# Altium project RFSOC_SAWG.PrjPCB (part 6 of 10)

## Sheet AWG_EEM_Connectors_JTAG.SchDoc: EEM Connectors,
size 420 x 297 mm; EDA_Number: ARTIQ; CompanyName: WUT ISE; DrawnBy: G.Kasprowicz; Organization: WUT ISE; DocumentNumber: 6; Revision: 1; SheetNumber: 6; SheetTotal: 20; Title2: JTAG switches; Designer: G.Kasprowicz; ModifiedDate: -; ProjectName: RFSOC_SAWG.PrjPCB
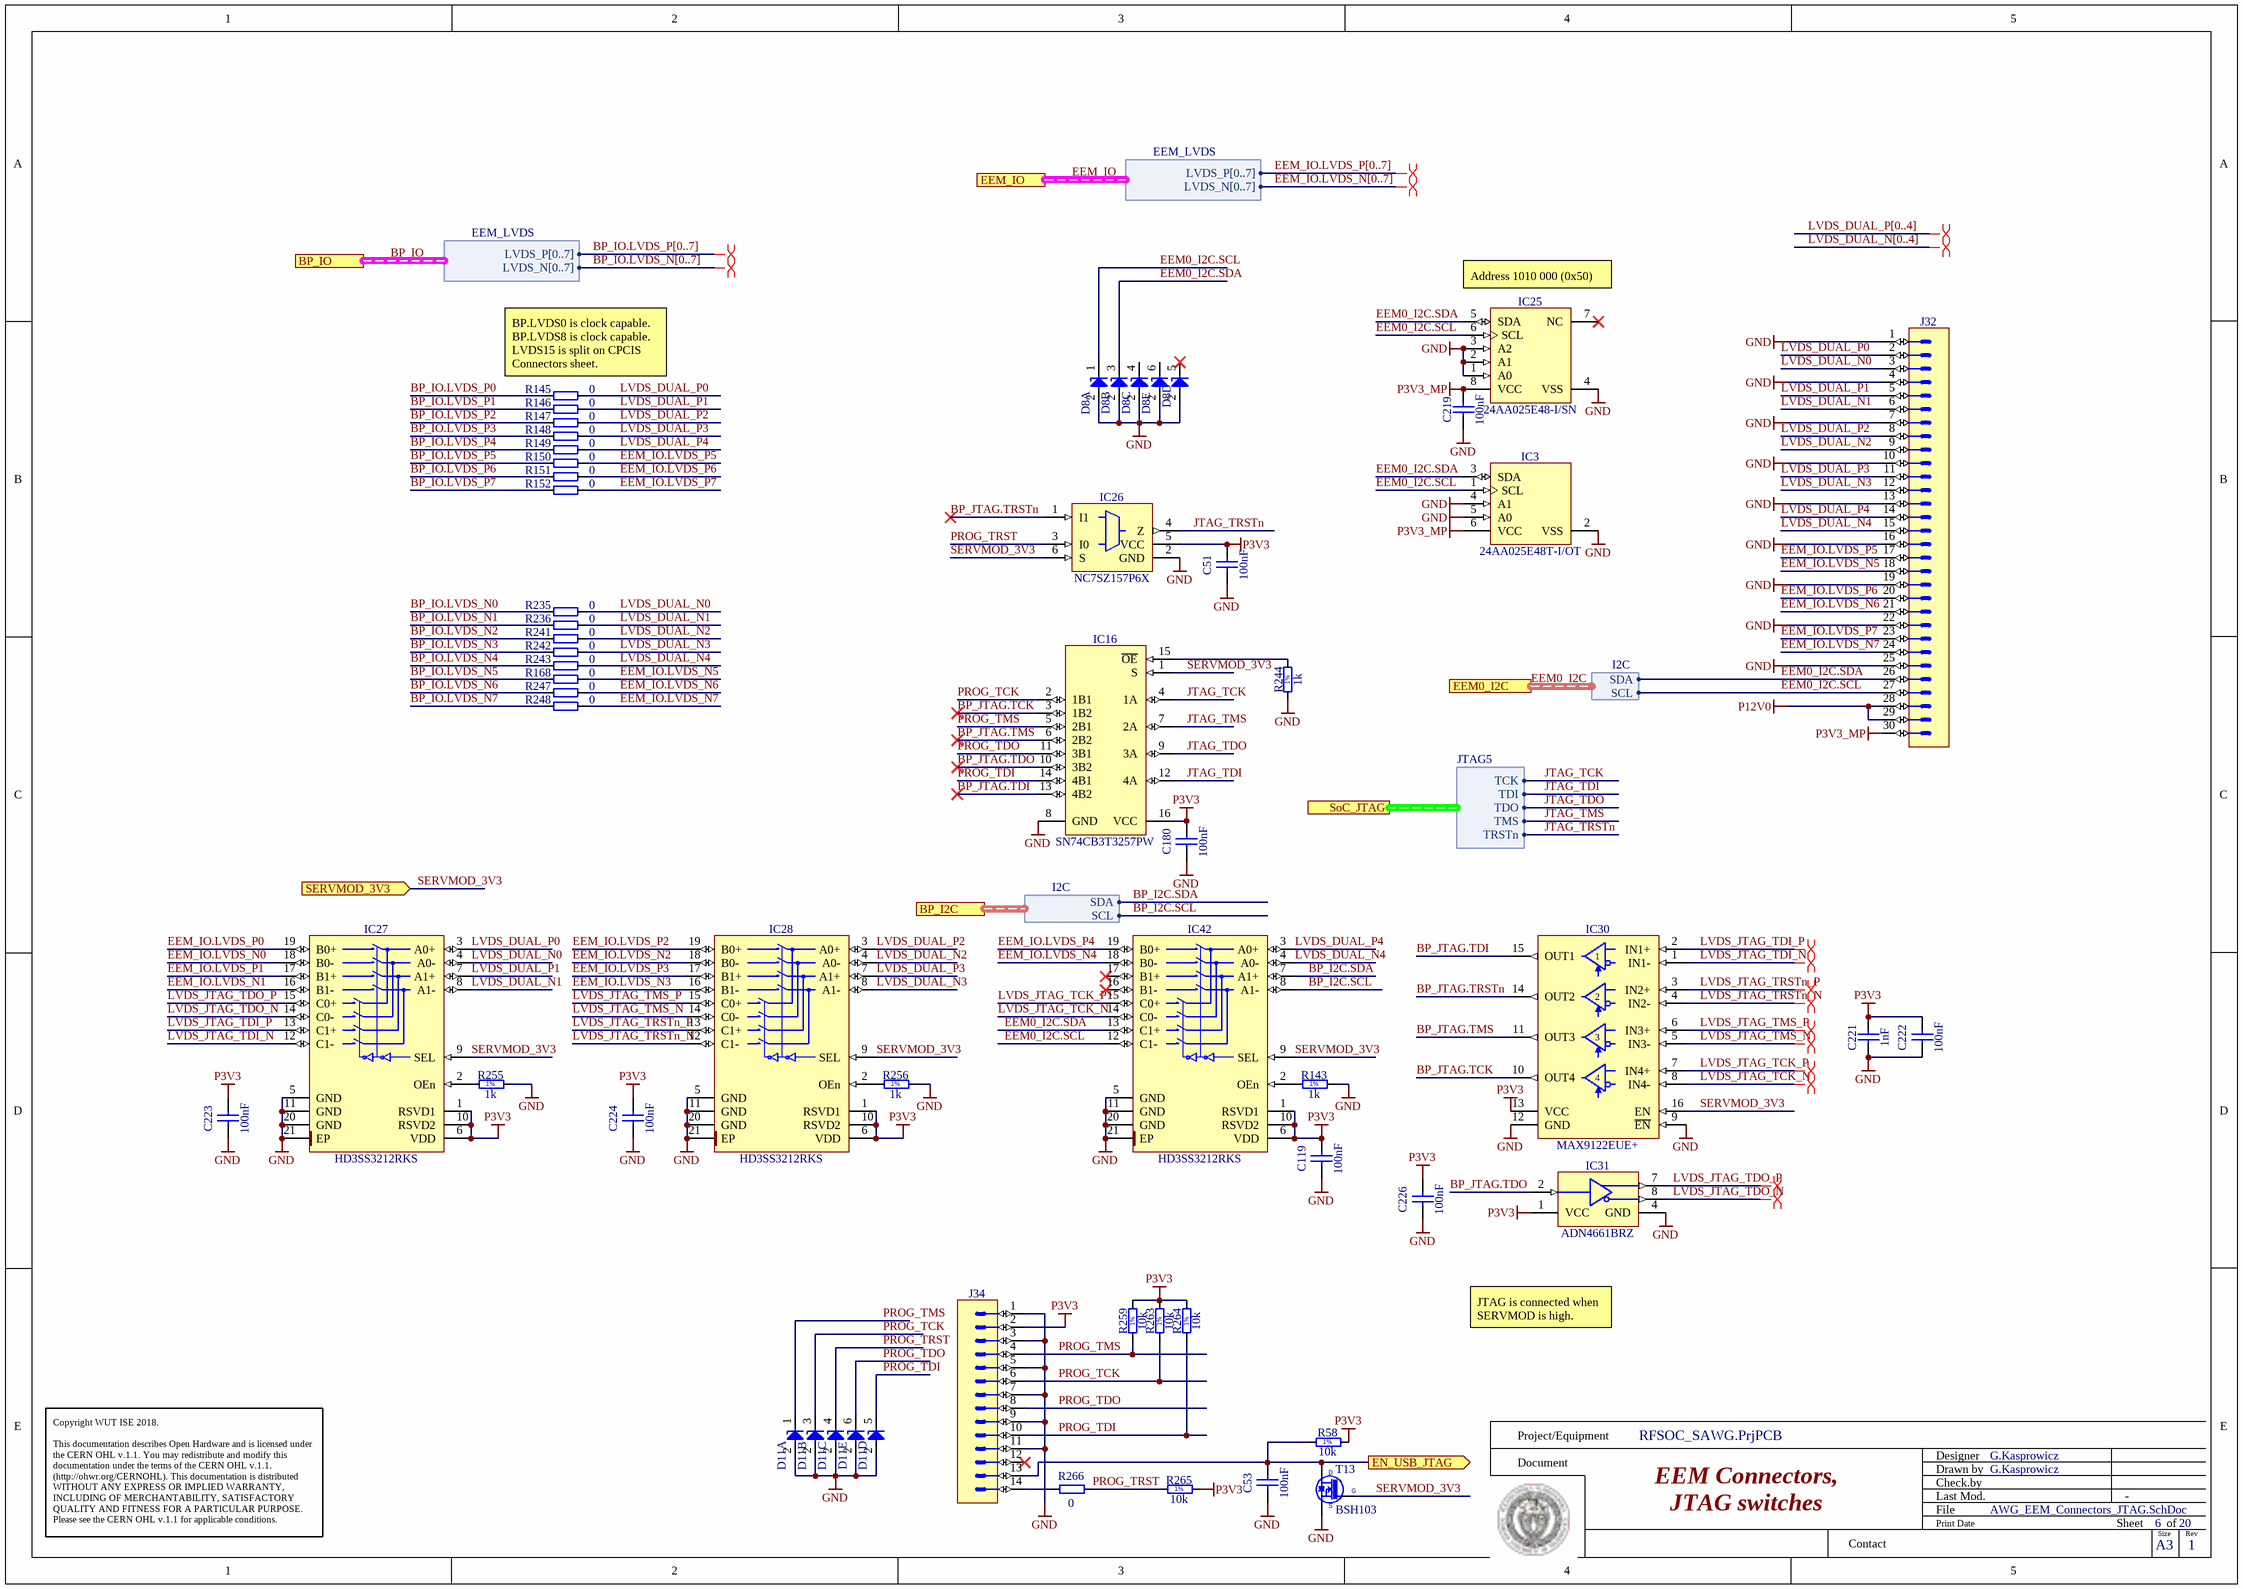
[diagram p11: AWG_EEM_Connectors_JTAG.SchDoc]

### Parts
C51  100nF  [CAPC1005X55N]
C53  100nF  [CAPC1005X55N]
C119  100nF  [CAPC1005X55N]
C180  100nF  [CAPC1005X55N]
C219  100nF  [CAPC1005X55N]
C221  1nF  [CAPC1005X55N]
C222  100nF  [CAPC1005X55N]
C223  100nF  [CAPC1005X55N]
C224  100nF  [CAPC1005X55N]
C226  100nF  [CAPC1005X55N]
D8  PESD3V3L5UY  [SOT65P210X110-6N]  (value not drawn)  (parts A,B,C,D,E of 5)
D11  PESD3V3L5UY  [SOT65P210X110-6N]  (value not drawn)  (parts A,B,C,D,E of 5)
IC3  24AA025E48T-I/OT  [SOT95P280X145-6N]
IC16  SN74CB3T3257PW  [SOP65P640X120-16N]
IC25  24AA025E48-I/SN  [SOIC127P600X175-8N]
IC26  NC7SZ157P6X  [SOT65P210X110-6N]
IC27  HD3SS3212RKS  [TEXAS_RKS0020A]
IC28  HD3SS3212RKS  [TEXAS_RKS0020A]
IC30  MAX9122EUE+  [SOP65P640X110-16N]
IC31  ADN4661BRZ  [SOIC127P600X175-8N]
IC42  HD3SS3212RKS  [TEXAS_RKS0020A]
J32  (no value)  [3M_N2530-6002RB]
J34  Milli-Grid™  [MOLEX_87832-1420]  (value not drawn)
R58  10k  [RESC1005X40N]
R143  1k  [RESC1005X40N]
R145  0  [RESC1005X40N]
R146  0  [RESC1005X40N]
R147  0  [RESC1005X40N]
R148  0  [RESC1005X40N]
R149  0  [RESC1005X40N]
R150  0  [RESC1005X40N]
R151  0  [RESC1005X40N]
R152  0  [RESC1005X40N]
R168  0  [RESC1005X40N]
R235  0  [RESC1005X40N]
R236  0  [RESC1005X40N]
R241  0  [RESC1005X40N]
R242  0  [RESC1005X40N]
R243  0  [RESC1005X40N]
R244  1k  [RESC1005X40N]
R247  0  [RESC1005X40N]
R248  0  [RESC1005X40N]
R255  1k  [RESC1005X40N]
R256  1k  [RESC1005X40N]
R259  10k  [RESC1005X40N]
R263  10k  [RESC1005X40N]
R264  10k  [RESC1005X40N]
R265  10k  [RESC1005X40N]
R266  0  [RESC1005X40N]
T13  BSH103  [SOT95P230X110-3N]

### Ports
BP_I2C (harness I2C), BP_IO (harness EEM_LVDS), EEM0_I2C (harness I2C), EEM_IO (harness EEM_LVDS), EN_USB_JTAG (out), SERVMOD_3V3 (in), SoC_JTAG (harness JTAG5)

### Harnesses
I2C: SDA, SCL
EEM_LVDS: LVDS_P[0..7], LVDS_N[0..7]
JTAG5: TCK, TDI, TDO, TMS, TRSTn

### Nets
GND: C51.1 C53.1 C119.1 C180.1 C219.1 C221.1 C222.1 C223.1 C224.1 C226.1 D8.2(A) D11.2(A) IC3.2(VSS) IC3.4(A1) IC3.5(A0) IC16.8(GND) IC25.1(A0) IC25.2(A1) IC25.3(A2) IC25.4(VSS) IC26.2(GND) IC27.5(GND) IC27.11(GND) IC27.20(GND) IC27.21(EP) IC28.5(GND) IC28.11(GND) IC28.20(GND) IC28.21(EP) IC30.9(~{EN}) IC30.12(GND) IC31.4(GND) IC42.5(GND) IC42.11(GND) IC42.20(GND) IC42.21(EP) J32.1 J32.4 J32.7 J32.10 J32.13 J32.16 J32.19 J32.22 J32.25 J34.1 J34.3 J34.5 J34.7 J34.9 J34.11 R143.2 R244.1 R255.2 R256.2 T13.2(S)
P3V3: C51.2 C119.2 C180.2 C221.2 C222.2 C223.2 C224.2 C226.2 IC16.16(VCC) IC26.5(VCC) IC27.1(RSVD1) IC27.6(VDD) IC27.10(RSVD2) IC28.1(RSVD1) IC28.6(VDD) IC28.10(RSVD2) IC30.13(VCC) IC31.1(VCC) IC42.1(RSVD1) IC42.6(VDD) IC42.10(RSVD2) J34.2 R58.2 R259.2 R263.2 R264.2 R265.2
P3V3_MP: C219.2 IC3.6(VCC) IC25.8(VCC) J32.30
P12V0: J32.28 J32.29
BP_I2C.SCL: IC42.8(A1-) ; port BP_I2C.SCL
BP_I2C.SDA: IC42.7(A1+) ; port BP_I2C.SDA
BP_IO.LVDS_N0: R235.1
BP_IO.LVDS_N1: R236.1
BP_IO.LVDS_N2: R241.1
BP_IO.LVDS_N3: R242.1
BP_IO.LVDS_N4: R243.1
BP_IO.LVDS_N5: R168.1
BP_IO.LVDS_N6: R247.1
BP_IO.LVDS_N7: R248.1
BP_IO.LVDS_P0: R145.1
BP_IO.LVDS_P1: R146.1
BP_IO.LVDS_P2: R147.1
BP_IO.LVDS_P3: R148.1
BP_IO.LVDS_P4: R149.1
BP_IO.LVDS_P5: R150.1
BP_IO.LVDS_P6: R151.1
BP_IO.LVDS_P7: R152.1
BP_JTAG.TCK: IC16.3(1B2) IC30.10(OUT4)
BP_JTAG.TDI: IC16.13(4B2) IC30.15(OUT1)
BP_JTAG.TDO: IC16.10(3B2) IC31.2(DIN)
BP_JTAG.TMS: IC16.6(2B2) IC30.11(OUT3)
BP_JTAG.TRSTn: IC26.1(I1) IC30.14(OUT2)
EEM0_I2C.SCL: D8.1(C) IC3.1(SCL) IC25.6(SCL) IC42.12(C1-) J32.27 ; port EEM0_I2C.SCL
EEM0_I2C.SDA: D8.3(C) IC3.3(SDA) IC25.5(SDA) IC42.13(C1+) J32.26 ; port EEM0_I2C.SDA
EEM_IO.LVDS_N0: IC27.18(B0-)
EEM_IO.LVDS_N1: IC27.16(B1-)
EEM_IO.LVDS_N2: IC28.18(B0-)
EEM_IO.LVDS_N3: IC28.16(B1-)
EEM_IO.LVDS_N4: IC42.18(B0-)
EEM_IO.LVDS_N5: J32.18 R168.2
EEM_IO.LVDS_N6: J32.21 R247.2
EEM_IO.LVDS_N7: J32.24 R248.2
EEM_IO.LVDS_P0: IC27.19(B0+)
EEM_IO.LVDS_P1: IC27.17(B1+)
EEM_IO.LVDS_P2: IC28.19(B0+)
EEM_IO.LVDS_P3: IC28.17(B1+)
EEM_IO.LVDS_P4: IC42.19(B0+)
EEM_IO.LVDS_P5: J32.17 R150.2
EEM_IO.LVDS_P6: J32.20 R151.2
EEM_IO.LVDS_P7: J32.23 R152.2
EN_USB_JTAG: C53.2 J34.13 R58.1 T13.3(D) ; port EN_USB_JTAG
JTAG_TCK: IC16.4(1A) ; port SoC_JTAG.TCK
JTAG_TDI: IC16.12(4A) ; port SoC_JTAG.TDI
JTAG_TDO: IC16.9(3A) ; port SoC_JTAG.TDO
JTAG_TMS: IC16.7(2A) ; port SoC_JTAG.TMS
JTAG_TRSTn: IC26.4(Z) ; port SoC_JTAG.TRSTn
LVDS_DUAL_N0: IC27.4(A0-) J32.3 R235.2
LVDS_DUAL_N1: IC27.8(A1-) J32.6 R236.2
LVDS_DUAL_N2: IC28.4(A0-) J32.9 R241.2
LVDS_DUAL_N3: IC28.8(A1-) J32.12 R242.2
LVDS_DUAL_N4: IC42.4(A0-) J32.15 R243.2
LVDS_DUAL_P0: IC27.3(A0+) J32.2 R145.2
LVDS_DUAL_P1: IC27.7(A1+) J32.5 R146.2
LVDS_DUAL_P2: IC28.3(A0+) J32.8 R147.2
LVDS_DUAL_P3: IC28.7(A1+) J32.11 R148.2
LVDS_DUAL_P4: IC42.3(A0+) J32.14 R149.2
LVDS_JTAG_TCK_N: IC30.8(IN4-) IC42.14(C0-)
LVDS_JTAG_TCK_P: IC30.7(IN4+) IC42.15(C0+)
LVDS_JTAG_TDI_N: IC27.12(C1-) IC30.1(IN1-)
LVDS_JTAG_TDI_P: IC27.13(C1+) IC30.2(IN1+)
LVDS_JTAG_TDO_N: IC27.14(C0-) IC31.8(DOUT-)
LVDS_JTAG_TDO_P: IC27.15(C0+) IC31.7(DOUT+)
LVDS_JTAG_TMS_N: IC28.14(C0-) IC30.5(IN3-)
LVDS_JTAG_TMS_P: IC28.15(C0+) IC30.6(IN3+)
LVDS_JTAG_TRSTn_N: IC28.12(C1-) IC30.4(IN2-)
LVDS_JTAG_TRSTn_P: IC28.13(C1+) IC30.3(IN2+)
PROG_TCK: D11.3(C) IC16.2(1B1) J34.6 R263.1
PROG_TDI: D11.5(C) IC16.14(4B1) J34.10 R264.1
PROG_TDO: D11.6(C) IC16.11(3B1) J34.8
PROG_TMS: D11.1(C) IC16.5(2B1) J34.4 R259.1
PROG_TRST: D11.4(C) IC26.3(I0) R265.1 R266.1
SERVMOD_3V3: IC16.1(S) IC26.6(S) IC27.9(SEL) IC28.9(SEL) IC30.16(EN) IC42.9(SEL) T13.1(G) ; port SERVMOD_3V3
NetIC16_15: IC16.15(~{OE}) R244.2
NetIC27_2: IC27.2(OEn) R255.1
NetIC28_2: IC28.2(OEn) R256.1
NetIC42_2: IC42.2(OEn) R143.1
NetJ34_14: J34.14 R266.2

Not connected (* = marked no-connect by the designer): D8 4(C) 5(C)* 6(C); IC25 7(NC)*; IC31 3(NC) 5(NC) 6(NC); IC42 16(B1-)* 17(B1+)*; J34 12*

### Buses and harness runs
bus BP_IO.LVDS_N[0..7]
bus BP_IO.LVDS_P[0..7]
bus EEM_IO.LVDS_N[0..7]
bus EEM_IO.LVDS_P[0..7]
bus LVDS_DUAL_N[0..4]
bus LVDS_DUAL_P[0..4]
harness BP_IO = port BP_IO
harness EEM0_I2C = port EEM0_I2C
harness EEM_IO = port EEM_IO

### Layout directives
differential pair; differential pair class Diff_100Ohm: (no net found under the mark), LVDS_JTAG_TCK_N, LVDS_JTAG_TCK_P, LVDS_JTAG_TDI_N, LVDS_JTAG_TDI_P, LVDS_JTAG_TDO_N, LVDS_JTAG_TDO_P, LVDS_JTAG_TMS_N, LVDS_JTAG_TMS_P, LVDS_JTAG_TRSTn_N, LVDS_JTAG_TRSTn_P

### Notes on the sheet
- (near IC25) Address 1010 000 (0x50)
- BP.LVDS0 is clock capable.
  BP.LVDS8 is clock capable.
  LVDS15 is split on CPCIS Connectors sheet.
- JTAG is connected when SERVMOD is high.
- Project/Equipment
- Document
- Designer
- Drawn by
- Check.by
- Copyright WUT ISE 2018.
  This documentation describes Open Hardware and is licensed under the CERN OHL v.1.1. You may redistribute and modify this documentation under the terms of the CERN OHL v.1.1. (http://ohwr.org/CERNOHL). This documentation is distributed WITHOUT ANY EXPRESS OR IMPLIED WARRANTY, INCLUDING OF MERCHANTABILITY, SATISFACTORY QUALITY AND FITNESS FOR A PARTICULAR PURPOSE. Please see the CERN OHL v.1.1 for applicable conditions.
- Contact
- File
- Last Mod.
- Print Date
- Sheet
- Size
- A3
- of
- Rev
- (in symbol R0402_1K_1%_0.0625W_100PPM) 1%
- (in symbol R0402_10K_1%_0.0625W_100PPM) 1%

### Library data of the parts
C51 C53 C119 C180 C219 C222-C224 C226 = CC0402_100NF_25V_10%_X7R_YUDEN_TMK105B7104KVHF: Non-polarised capacitor; Part Description: SMD Multilayer Chip Ceramic Capacitor (High Dielectric Type) for Automotive / Industrial Applications; Manufacturer: TAIYO YUDEN; Voltage: 25V; TC: X7R; Tolerance: ±10%; Part Number: CC0402_100NF_25V_10%_X7R_YUDEN_TMK105B7104KVHF; Component Kind: Standard; Component Type: Standard; Pin Count: 2; Value: 100nF; Status: Not Recommended; Manufacturer Part Number: TMK105B7104KVHF; Case: 0402; Mounted: Yes; Socket: No; SMD: Yes; Sense: No; HelpURL: \\cern.ch\dfs\Applications\Altium\Datasheets\CC0402_TAIYO-YUDEN_TMK105B7104KVHF.pdf; Author: CERN DEM JLC; CreateDate: 10-May-17; LatestRevisionDate: 10-May-17; ComponentHeight: 0.55mm
C221 = CC0402_1NF_50V_10%_X7R: Non-polarised capacitor; Manufacturer: GENERIC; Part Description: SMD Multilayer Chip Ceramic Capacitor; Manufacturer1 Part Number: 223858715623; Tolerance: ±10%; Voltage: 50V; TC: X7R; Manufacturer Part Number: CC0402_1NF_50V_10%_X7R; Part Number: CC0402_1NF_50V_10%_X7R; Value: 1nF; Component Kind: Standard; Component Type: Standard; Pin Count: 2; Status: Not Recommended; Case: 0402; Mounted: Yes; Socket: No; SMD: Yes; Sense: No; Manufacturer1 Example: PHYCOMP; Manufacturer1 ComponentHeight: 0.55mm; HelpURL: \\cern.ch\dfs\Applications\Altium\Datasheets\CC0402_X7R_PHYCOMP.pdf; Author: CERN DEM JLC; CreateDate: 03.12.2007; LatestRevisionDate: 03.12.2007
D8 D11 = PESD3V3L5UY: as D6 on sheet AWG_CPCIS_Connectors_P1_P6; Part Number: PESD3V3L5UY; Component Kind: Standard; Component Type: Standard; Device: PESD3V3L5UY; PackageDescription: SOT363, SC-88, 0.65mm Pitch; 6 Pin, 1.25mm W X 2.00mm L X 1.10mm H body, IPC Medium Density; Manufacturer Part Number: PESD3V3L5UY; Pin Count: 6; Case: SOT363; Mounted: Yes; Socket: No; SMD: Yes; Sense: No; ComponentHeight: 1.1mm; HelpURL: \\cern.ch\dfs\Applications\Altium\Datasheets\PESD3V3L5UY.pdf; Author: CERN DEM WB; CreateDate: 05.07.2021; LatestRevisionDate: 05.07.2021
IC3 = 24AA025E48T-I/OT: 1.7V-5.5V, 2K I2C Serial EEPROM With EUI-48 Node Identity; Part Description: 1.7V-5.5V, 2K I2C Serial EEPROM with EUI-48™ Node Identity; Cascadable; Manufacturer: MICROCHIP TECHNOLOGY; PressFit: No; Bonding: No; Part Number: 24AA025E48T-I/OT; Component Kind: Standard; Component Type: Standard; Device: 24AA025E48T-I/OT; PackageDescription: SOT, 0.95mm pitch; 6 pin, 1.60mm W X 2.90mm L X 1.45mm H body, IPC Medium Density; Manufacturer Part Number: 24AA025E48T-I/OT; Pin Count: 6; Case: SOT23-6; Mounted: Yes; Socket: No; SMD: Yes; Sense: No; ComponentHeight: 1.45mm; HelpURL: \\cern.ch\dfs\Applications\Altium\Datasheets\24AA025E48T-I-OT.pdf; Author: CERN DEM BC; CreateDate: 06.12.2019; LatestRevisionDate: 06.12.2019
IC16 = SN74CB3T3257PW: 4-BIT 1-OF-2 FET Multiplexer/Demultiplexer 2.5V/3.3V Low-Voltage Bus Switch 5V Tolerant Shifter; Manufacturer: TEXAS INSTRUMENTS; PressFit: No; Bonding: No; Part Number: SN74CB3T3257PW; Component Kind: Standard; Component Type: Standard; Device: SN74CB3T3257PW; PackageDescription: SOP, 0.65mm Pitch; 16 Pin, 4.40mm W X 5.00mm L X 1.20mm H body, IPC Medium Density; Part Description: 4-Bit 1-of-2 FET Multiplexer/Demultiplexer 2.5V/3.3V Low-Voltage Bus Switch 5V Tolerant Shifter; Manufacturer Part Number: SN74CB3T3257PW; Pin Count: 16; Case: TSSOP16; Mounted: Yes; Socket: No; SMD: Yes; Sense: No; ComponentHeight: 1.2mm; Author: CERN DEM JLC; HelpURL: \\cern.ch\dfs\Applications\Altium\Datasheets\SN74CB3T3257PW.pdf; CreateDate: 2012-01-30; LatestRevisionDate: 2012-01-30
IC25 = 24AA025E48-I/SN: 1.7V-5.5V, 2K I2C™ Serial EEPROMs with EUI-48™ Node Identity; Manufacturer: MICROCHIP TECHNOLOGY; PressFit: No; Bonding: No; Part Number: 24AA025E48-I/SN; Component Kind: Standard; Component Type: Standard; Device: 24AA025E48-I/SN; PackageDescription: SOIC 8, Pitch 1.27mm - Body 4x5mm, IPC Medium Density; Part Description: 1.7V-5.5V, 2K I2C™ Serial EEPROMs with EUI-48™ Node Identity; Manufacturer Part Number: 24AA025E48-I/SN; Pin Count: 8; Case: SOIC8; Mounted: Yes; Socket: No; SMD: Yes; Sense: No; ComponentHeight: 1.75mm; HelpURL: \\cern.ch\dfs\Applications\Altium\Datasheets\24AA025E48-I-SN.pdf; Author: CERN DEM MR; CreateDate: 19.07.2016; LatestRevisionDate: 19.07.2016
IC26 = NC7SZ157P6X: TinyLogic® UHS 2-Input Non-Inverting Multiplexer; Manufacturer: FAIRCHILD SEMICONDUCTOR; PressFit: No; Bonding: No; Manufacturer Part Number: NC7SZ157P6X; PackageDescription: SOT363, 0.65mm pitch; 6 pin, 1.40mm W X 2.15mm L, IPC Medium Density; Part Description: TinyLogic® UHS 2-Input Non-Inverting Multiplexer; Part Number: NC7SZ157P6X; Component Kind: Standard; Component Type: Standard; Device: NC7SZ157P6X; Pin Count: 6; Case: SOT363; Mounted: Yes; Socket: No; SMD: Yes; Sense: No; ComponentHeight: 1.1mm; Author: CERN DEM JLC; HelpURL: \\cern.ch\dfs\Applications\Altium\Datasheets\NC7SZ157P6X.pdf; CreateDate: 22.03.2012; LatestRevisionDate: 22.03.2012
IC27 IC28 IC42 = HD3SS3212RKS: Two-Channel Differential 2:1/1:2 USB3.1 Mux/Demux; Manufacturer: TEXAS INSTRUMENTS; PressFit: No; Bonding: No; Part Number: HD3SS3212RKS; Component Kind: Standard; Component Type: Standard; Device: HD3SS3212RKS; PackageDescription: QFN, TEXAS Case Style RKS, 0.50mm Pitch, Rect.; 20 Pin, 2.50mm L X 4.50mm W X 1.00mm H body (w/Thermal Tab 1.1mm X 3.1mm); Part Description: Two-Channel Differential 2:1/1:2 USB3.1 Mux/Demux; Manufacturer Part Number: HD3SS3212RKS; Pin Count: 21; Case: TQFN20; Mounted: Yes; Socket: No; SMD: Yes; Sense: No; ComponentHeight: 1mm; Author: CERN DEM BC; HelpURL: \\cern.ch\dfs\Applications\Altium\Datasheets\HD3SS3212RKS.pdf; CreateDate: 2019-11-06; LatestRevisionDate: 2019-11-06
IC30 = MAX9122EUE+: Quad LVDS Line Receivers with Integrated Termination and Flow-Through Pinout; Manufacturer: MAXIM; PressFit: No; Bonding: No; Part Number: MAX9122EUE+; Component Kind: Standard; Component Type: Standard; Device: MAX9122EUE+; PackageDescription: SOP, 0.65mm Pitch; 16 Pin, 4.40mm W X 5.00mm L X 1.10mm H body, IPC Medium Density; Part Description: Quad LVDS Line Receivers with Integrated Termination and Flow-Through Pinout; Manufacturer Part Number: MAX9122EUE+; Pin Count: 16; Case: TSSOP16; Mounted: Yes; Socket: No; SMD: Yes; Sense: No; ComponentHeight: 1.1mm; Author: CERN DEM MR; HelpURL: \\cern.ch\dfs\Applications\Altium\Datasheets\MAX9122EUE+.pdf; CreateDate: 2015-12-14; LatestRevisionDate: 2015-12-14
IC31 = ADN4661BRZ: Single, 3V, CMOS, LVDS, High Speed Differential Driver; Manufacturer: ANALOG DEVICES; PressFit: No; Bonding: No; Part Number: ADN4661BRZ; Component Kind: Standard; Component Type: Standard; Device: ADN4661BRZ; PackageDescription: SOIC 8, Pitch 1.27mm - Body 4x5mm, IPC Medium Density; Part Description: Single, 3V, CMOS, LVDS, High Speed Differential Driver; Manufacturer Part Number: ADN4661BRZ; Pin Count: 8; Case: SOIC8; Mounted: Yes; Socket: No; SMD: Yes; Sense: No; ComponentHeight: 1.75mm; Author: CERN DEM JMW; HelpURL: \\cern.ch\dfs\Applications\Altium\Datasheets\ADN4661BRZ.pdf; CreateDate: 2014-02-26; LatestRevisionDate: 2014-02-26
J32 = 3M_N2530-6002RB: Connector 30 Male; Part Description: 30 Contacts - Straight .100'' x .100'' Low Profile Four-Wall Header, 2500 Series; Manufacturer: 3M; PressFit: No; Part Number: 3M_N2530-6002RB; Component Kind: Standard; Component Type: Standard; Pin Count: 30; Family: Header 30; Mounted: Yes; Socket: No; SMD: No; Sense: No; Status: None; Manufacturer Part Number: N2530-6002RB; ComponentHeight: 10.03mm; HelpURL: \\cern.ch\dfs\Applications\Altium\Datasheets\3M_N2530-6002RB.pdf; Author: CERN DEM JLC; CreateDate: 11.02.2009; LatestRevisionDate: 11.08.2009
J34 = MOLEX_87832-1420: Connector 14 Male; Part Description: 2.00mm (.079") Pitch Milli-Grid™ Header, Surface Mount, Vertical, Shrouded, 14 Circuits,with Locking Windows and Centre Polarization Slot, PCB Locator; Manufacturer: MOLEX; PressFit: No; Part Number: MOLEX_87832-1420; Component Kind: Standard; Component Type: Standard; Pin Count: 14; Family: Milli-Grid™; Mounted: Yes; Socket: No; SMD: Yes; Sense: No; Status: None; Manufacturer Part Number: 87832-1420; ComponentHeight: 7.6mm; HelpURL: \\cern.ch\dfs\Applications\Altium\Datasheets\MOLEX_87832-1420.pdf; Author: CERN DEM JLC; CreateDate: 09.09.2008; LatestRevisionDate: 09.09.2008
R58 R259 R263-R265 = R0402_10K_1%_0.0625W_100PPM: Resistor - 1%; Part Description: General Purpose Thick Film Chip Resistor; Manufacturer: GENERIC; Manufacturer1 Part Number: 232270671003L; TC: ±100ppm/°C; PressFit: No; Part Number: R0402_10K_1%_0.0625W_100PPM; Component Kind: Standard; Component Type: Standard; Pin Count: 2; Value: 10k; Status: Not Recommended; Power: 0.0625W; Tolerance: ±1%; Manufacturer Part Number: R0402_10K_1%_0.0625W_100PPM; Case: 0402; Mounted: Yes; Sense: No; Socket: No; SMD: Yes; Manufacturer1 Example: YAGEO PHYCOMP; Manufacturer1 ComponentHeight: 0.4mm; HelpURL: \\cern.ch\dfs\Applications\Altium\Datasheets\R0402_Phycomp_RC0402.pdf; Author: CERN DEM JLC
  R58: CreateDate: 03.12.2007; LatestRevisionDate: 17.10.2012; ClassName: FPGA_JTAG
  R259 R263-R265: CreateDate: 2007-12-03; LatestRevisionDate: 2012-10-17
R143 R244 R255 R256 = R0402_1K_1%_0.0625W_100PPM: Resistor - 1%; Part Description: General Purpose Thick Film Chip Resistor; Manufacturer: GENERIC; Manufacturer1 Part Number: 232270671002L; TC: ±100ppm/°C; PressFit: No; Part Number: R0402_1K_1%_0.0625W_100PPM; Component Kind: Standard; Component Type: Standard; Pin Count: 2; Value: 1k; Status: Not Recommended; Power: 0.0625W; Tolerance: ±1%; Manufacturer Part Number: R0402_1K_1%_0.0625W_100PPM; Case: 0402; Mounted: Yes; Sense: No; Socket: No; SMD: Yes; Manufacturer1 Example: YAGEO PHYCOMP; Manufacturer1 ComponentHeight: 0.4mm; HelpURL: \\cern.ch\dfs\Applications\Altium\Datasheets\R0402_Phycomp_RC0402.pdf; Author: CERN DEM JLC; CreateDate: 2007-12-03; LatestRevisionDate: 2012-10-17
R145-R152 R168 R235 R236 R241-R243 R247 R248 = R0402_0R_JUMPER: Resistor; Part Description: 1A (0.05R Max DC Resistance) Zero Ohm Jumper; Manufacturer: GENERIC; Manufacturer1 Part Number: 232270591001L; PressFit: No; Part Number: R0402_0R_JUMPER; Component Kind: Standard; Component Type: Standard; Pin Count: 2; Value: 0; Status: Not Recommended; Manufacturer Part Number: R0402_0R_JUMPER; Case: 0402; Mounted: Yes; Sense: No; Socket: No; SMD: Yes; Manufacturer1 Example: YAGEO PHYCOMP; Manufacturer1 ComponentHeight: 0.4mm; HelpURL: \\cern.ch\dfs\Applications\Altium\Datasheets\R0402_Phycomp_RC0402.pdf; Author: CERN DEM JLC; CreateDate: 03.12.2007; LatestRevisionDate: 17.10.2012
R266 = R0402_0R_JUMPER: Resistor; Manufacturer: GENERIC; Part Description: 1A (0.05R Max DC Resistance) Zero Ohm Jumper; Manufacturer1 Part Number: 232270591001L; PressFit: No; Manufacturer Part Number: R0402_0R_JUMPER; Part Number: R0402_0R_JUMPER; Value: 0; Component Kind: Standard; Component Type: Standard; Pin Count: 2; Status: Not Recommended; Case: 0402; Mounted: Yes; Sense: No; Socket: No; SMD: Yes; Manufacturer1 Example: YAGEO PHYCOMP; Manufacturer1 ComponentHeight: 0.4mm; HelpURL: \\cern.ch\dfs\Applications\Altium\Datasheets\R0402_Phycomp_RC0402.pdf; Author: CERN DEM JLC; CreateDate: 03.12.2007; LatestRevisionDate: 17.10.2012
T13 = BSH103: as T18 on sheet AWG_CPCIS_Connectors_P1_P6; Part Number: BSH103; Component Kind: Standard; Component Type: Standard; Device: BSH103; PackageDescription: SOT23, 3 pin, Pitch 0.95mm - 1.3mm W X 2.9mm L X 1.1mm H, IPC Medium Density; Manufacturer Part Number: BSH103; Pin Count: 3; Case: SOT23-3; Mounted: Yes; Socket: No; SMD: Yes; Sense: No; ComponentHeight: 1.1mm; HelpURL: \\cern.ch\dfs\Applications\Altium\Datasheets\BSH103.pdf; Author: CERN DEM JLC; CreateDate: 16.03.2010; LatestRevisionDate: 20.06.2017

## Sheet DAC_Output_CH.SchDoc: RFSOC_SAWG
size 420 x 297 mm; Author: G.Kasprowicz; CompanyName: WUT ISE; DrawnBy: G.Kasprowicz; Organization: WUT ISE; Address1: PW ISE; Address2: Nowowiejska 15/19 00-665 Warsaw; Address3: gkasprow@gmail.com; DocumentNumber: 12; Revision: 1; SheetNumber: 12; SheetTotal: 20; ModifiedBy: -; CheckedDate: -; Title2: DAC Output; DivGrp: WUT ISE; Designer: G.Kasprowicz; ModifiedDate: -; ProjectName: Sensor Box
Used 8 times, as channels U_DAC_Output_CH0, U_DAC_Output_CH1, U_DAC_Output_CH2, U_DAC_Output_CH3, U_DAC_Output_CH4, U_DAC_Output_CH5, U_DAC_Output_CH6, U_DAC_Output_CH7. Parts and nets are listed once, with the designators drawn on the sheet.
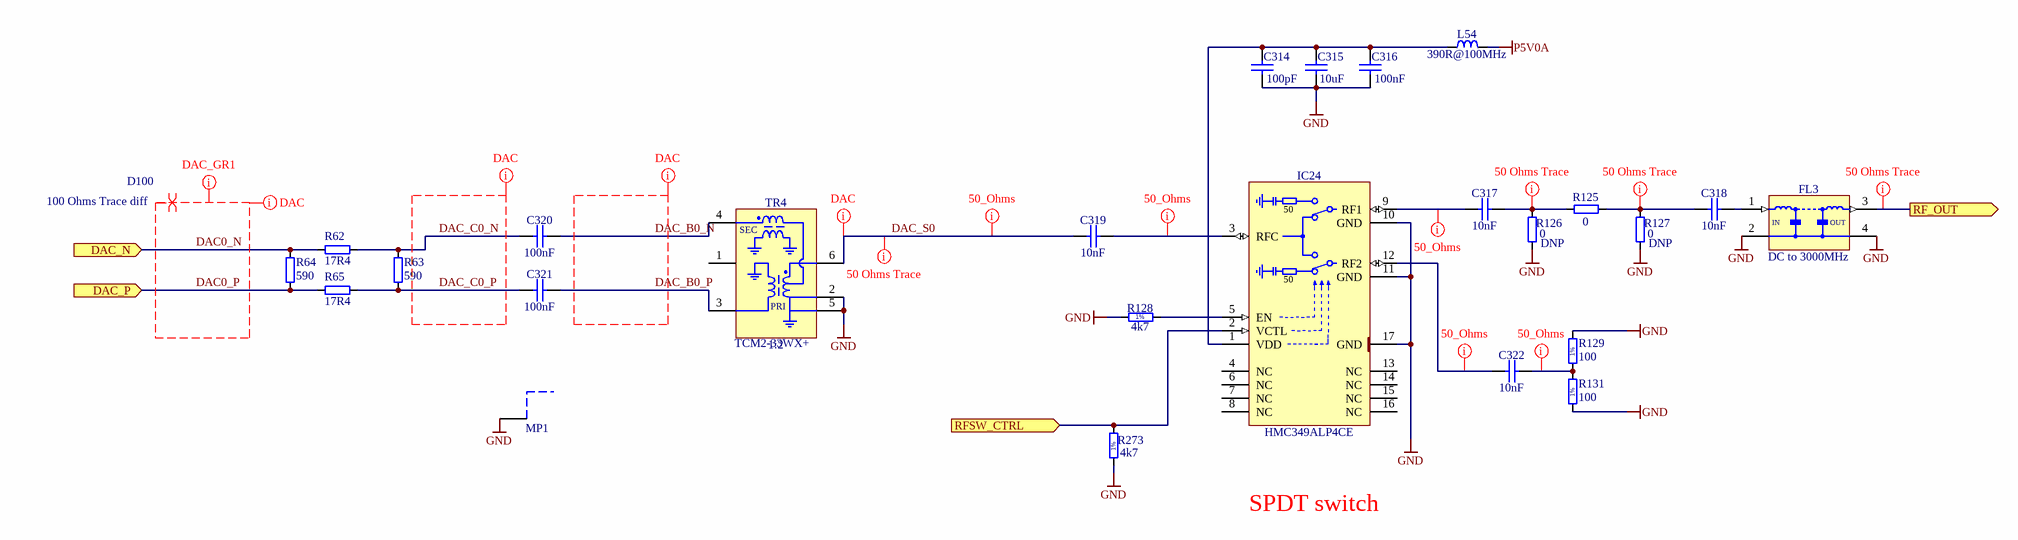
[diagram p12: DAC_Output_CH.SchDoc]

### Parts
C314  100pF  [CAPC1005X55N]
C315  10uF  [CAPC1608X80N]
C316  100nF  [CAPC1005X55N]
C317  10nF  [CAPC1005X55N]
C318  10nF  [CAPC1005X55N]
C319  10nF  [CAPC1005X55N]
C320  100nF  [CAPC0603X33N]
C321  100nF  [CAPC0603X33N]
C322  10nF  [CAPC1005X55N]
FL3  DC to 3000MHz  [FIL_MINI-CIRCUITS_FV1206]
IC24  HMC349ALP4CE  [QFN65P400X400X100-17N-S255]
L54  390R@100MHz  [INDC1608X95N]
MP1  3670230  [3670230]  (value not drawn)
R62  17R4  [RESC1005X40N]
R63  590  [RESC1005X40N]
R64  590  [RESC1005X40N]
R65  17R4  [RESC1005X40N]
R125  0  [RESC1005X40N]
R126  0  Mounted: DNP  [RESC1005X40N]
R127  0  Mounted: DNP  [RESC1005X40N]
R128  4k7  [RESC1005X40N]
R129  100  [RESC1005X40N]
R131  100  [RESC1005X40N]
R273  4k7  [RESC1005X40N]
TR4  1:2  Manufacturer Part Number: TCM2-33WX+  [XFMR_MINI-CIRCUITS_DB1627]

### Ports
DAC_N (in), DAC_P (in), RF_OUT (out), RFSW_CTRL (in)

### Nets
GND: C314.2 C315.1 C316.1 FL3.2(GND) FL3.4(GND) IC24.10(GND) IC24.11(GND) IC24.17(GND) MP1.1 R126.1 R127.1 R128.1 R129.2 R131.1 R273.1 TR4.2(P) TR4.5(GND)
P5V0A: L54.2
DAC0_N: R62.2 R64.1 ; port DAC_N
DAC0_P: R64.2 R65.2 ; port DAC_P
DAC_B0_N: C320.2 TR4.4(SD)
DAC_B0_P: C321.2 TR4.3(S)
DAC_C0_N: C320.1 R62.1 R63.1
DAC_C0_P: C321.1 R63.2 R65.1
DAC_S0: C319.1 TR4.6(P1)
RF_OUT: FL3.3(RFOUT) ; port RF_OUT
RFSW_CTRL: IC24.2(VCTL) R273.2 ; port RFSW_CTRL
NetC314_1: C314.1 C315.2 C316.2 IC24.1(VDD) L54.1
NetC317_1: C317.1 IC24.9(RF1)
NetC317_2: C317.2 R125.1 R126.2
NetC318_1: C318.1 R125.2 R127.2
NetC318_2: C318.2 FL3.1(RFIN)
NetC319_2: C319.2 IC24.3(RFC)
NetC322_1: C322.1 IC24.12(RF2)
NetC322_2: C322.2 R129.1 R131.2
NetIC24_5: IC24.5(EN) R128.2

Not connected (* = marked no-connect by the designer): IC24 4(NC) 6(NC) 7(NC) 8(NC) 13(NC) 14(NC) 15(NC) 16(NC); TR4 1(NC)

### Channels
U_DAC_Output_CH0: designators end in A; ports DAC_N=DAC0_N DAC_P=DAC0_P RF_OUT=DAC_OUT0 RFSW_CTRL=RFSW_CTRL0
U_DAC_Output_CH1: designators end in B; ports DAC_N=DAC0_N DAC_P=DAC0_P RF_OUT=DAC_OUT1 RFSW_CTRL=RFSW_CTRL1
U_DAC_Output_CH2: designators end in C; ports DAC_N=DAC0_N DAC_P=DAC0_P RF_OUT=DAC_OUT2 RFSW_CTRL=RFSW_CTRL2
U_DAC_Output_CH3: designators end in D; ports DAC_N=DAC0_N DAC_P=DAC0_P RF_OUT=DAC_OUT3 RFSW_CTRL=RFSW_CTRL3
U_DAC_Output_CH4: designators end in E; ports DAC_N=DAC0_N DAC_P=DAC0_P RF_OUT=DAC_OUT4 RFSW_CTRL=RFSW_CTRL4
U_DAC_Output_CH5: designators end in F; ports DAC_N=DAC0_N DAC_P=DAC0_P RF_OUT=DAC_OUT5 RFSW_CTRL=RFSW_CTRL5
U_DAC_Output_CH6: designators end in G; ports DAC_N=DAC0_N DAC_P=DAC0_P RF_OUT=DAC_OUT6 RFSW_CTRL=RFSW_CTRL6
U_DAC_Output_CH7: designators end in H; ports DAC_N=DAC0_N DAC_P=DAC0_P RF_OUT=DAC_OUT7 RFSW_CTRL=RFSW_CTRL7

### Layout directives
net class DAC_GR1: DAC0_N, DAC0_P
differential pair; differential pair class 100 Ohms Trace diff; net class D100: DAC0_N, DAC0_P
net class 50 Ohms Trace: DAC_OUT0, DAC_S0_U_DAC_Output_CH0, NetC317A_2, NetC318A_1
net class DAC: DAC0_N, DAC0_P, DAC_B0_N, DAC_B0_P, DAC_C0_N, DAC_C0_P, DAC_S0_U_DAC_Output_CH0
net class 50_Ohms: DAC_S0_U_DAC_Output_CH0, NetC317A_1, NetC319A_2, NetC322A_1, NetC322A_2

### Notes on the sheet
- SPDT switch
- Project/Equipment
- Document
- Designer
- Drawn by
- Check.by
- Copyright WUT ISE 2020.
  This documentation describes Open Hardware and is licensed under the CERN OHL v.1.2. You may redistribute and modify this documentation under the terms of the CERN OHL v.1.2. (http://ohwr.org/CERNOHL). This documentation is distributed WITHOUT ANY EXPRESS OR IMPLIED WARRANTY, INCLUDING OF MERCHANTABILITY, SATISFACTORY QUALITY AND FITNESS FOR A PARTICULAR PURPOSE. Please see the CERN OHL v.1.2 for applicable conditions.
- Contact
- File
- Last Mod.
- Print Date
- Sheet
- Size
- A3
- of
- Rev
- (in symbol FIL_MINI-CIRCUITS_LFCN-3000+) IN; OUT
- (in symbol HMC349ALP4CE) 50
- (in symbol R0402_4K7_1%_0.0625W_100PPM) 1%
- (in symbol R0402_100R_1%_0.1W_100PPM) 1%
- (in symbol XFMR_MINI-CIRCUITS_TCM2-33WX+) SEC; PRI

### Library data of the parts
C314 = CC0402_100PF_50V_5%_C0G: Non-polarised capacitor; Part Description: SMD Multilayer Chip Ceramic Capacitor; Manufacturer: GENERIC; Manufacturer1 Part Number: C0402C101J5GACTU; Voltage: 50V; TC: C0G/NP0; Tolerance: ±5%; Part Number: CC0402_100PF_50V_5%_C0G; Component Kind: Standard; Component Type: Standard; Pin Count: 2; Value: 100pF; Status: Preferred; Manufacturer Part Number: CC0402_100PF_50V_5%_C0G; Case: 0402; Mounted: Yes; Socket: No; SMD: Yes; Sense: No; Manufacturer1 Example: KEMET; Manufacturer1 ComponentHeight: 0.55mm; HelpURL: \\cern.ch\dfs\Applications\Altium\Datasheets\CC0805_C0G_KEMET_(Commercial Grade).pdf; Author: CERN DEM JLC; CreateDate: 2007-12-03; LatestRevisionDate: 2015-04-22
C315 = CC0603_10UF_16V_20%_X5R: Non-polarised capacitor; Part Description: SMD Multilayer Chip Ceramic Capacitor; Manufacturer: GENERIC; Manufacturer1 Part Number: GRM188R61C106MA73D; Voltage: 16V; TC: X5R; Tolerance: ±20%; Part Number: CC0603_10UF_16V_20%_X5R; Component Kind: Standard; Component Type: Standard; Pin Count: 2; Value: 10uF; Status: None; Manufacturer Part Number: CC0603_10UF_16V_20%_X5R; Case: 0603; Mounted: Yes; Socket: No; SMD: Yes; Sense: No; Manufacturer1 Example: MURATA; Manufacturer1 ComponentHeight: 0.8mm; HelpURL: \\cern.ch\dfs\Applications\Altium\Datasheets\CC0603_X5R_MURATA_GRM.pdf; Author: CERN DEM MR; CreateDate: 2016-03-02; LatestRevisionDate: 2016-03-02
C316 = CC0402_100NF_16V_10%_X7R: Non-polarised capacitor; Part Description: SMD Multilayer Chip Ceramic Capacitor; Manufacturer: GENERIC; Manufacturer1 Part Number: GRM155R71C104KA88D; Voltage: 16V; TC: X7R; Tolerance: ±10%; Part Number: CC0402_100NF_16V_10%_X7R; Component Kind: Standard; Component Type: Standard; Pin Count: 2; Value: 100nF; Status: Not Recommended; Manufacturer Part Number: CC0402_100NF_16V_10%_X7R; Case: 0402; Mounted: Yes; Socket: No; SMD: Yes; Sense: No; Manufacturer1 Example: MURATA; Manufacturer1 ComponentHeight: 0.55mm; HelpURL: \\cern.ch\dfs\Applications\Altium\Datasheets\CC0402_X7R_MURATA_GRM.pdf; Author: CERN DEM JLC; CreateDate: 2013-12-05; LatestRevisionDate: 2007-12-03
C317-C319 C322 = CC0402_10NF_16V_10%_X7R: Non-polarised capacitor; Part Description: SMD Multilayer Chip Ceramic Capacitor; Manufacturer: GENERIC; Manufacturer1 Part Number: 223878715636; Voltage: 16V; TC: X7R; Tolerance: ±10%; Part Number: CC0402_10NF_16V_10%_X7R; Component Kind: Standard; Component Type: Standard; Pin Count: 2; Value: 10nF; Status: Not Recommended; Manufacturer Part Number: CC0402_10NF_16V_10%_X7R; Case: 0402; Mounted: Yes; Socket: No; SMD: Yes; Sense: No; Manufacturer1 Example: PHYCOMP; Manufacturer1 ComponentHeight: 0.55mm; HelpURL: \\cern.ch\dfs\Applications\Altium\Datasheets\CC0402_X7R_PHYCOMP.pdf; Author: CERN DEM JLC; CreateDate: 2007-12-03; LatestRevisionDate: 2007-12-03
C320 C321 = CC0201_100NF_6.3V_10%_X5R: Non-polarised capacitor; Part Description: SMD Multilayer Chip Ceramic Capacitor; Manufacturer: GENERIC; Manufacturer1 Part Number: 02016D104KAT2A; Voltage: 6.3V; TC: X5R; Tolerance: ±10%; Part Number: CC0201_100NF_6.3V_10%_X5R; Component Kind: Standard; Component Type: Standard; Pin Count: 2; Value: 100nF; Status: Not Recommended; Manufacturer Part Number: CC0201_100NF_6.3V_10%_X5R; Case: 0201; Mounted: Yes; Socket: No; SMD: Yes; Sense: No; Manufacturer1 Example: AVX; Manufacturer1 ComponentHeight: 0.33mm; HelpURL: \\cern.ch\dfs\Applications\Altium\Datasheets\CC0201_X5R_AVX.pdf; Author: CERN DEM JLC; CreateDate: 03.12.2007; LatestRevisionDate: 03.12.2007
FL3 = FIL_MINI-CIRCUITS_LFCN-3000+: 50 Ohm Low Pass Filter; Part Number: FIL_MINI-CIRCUITS_LFCN-3000+; Component Kind: Standard; Component Type: Standard; Pin Count: 4; Value: DC to 3000MHz; Part Description: 50 Ohm Low Pass Filter; Manufacturer: MINI-CIRCUITS; Manufacturer Part Number: LFCN-3000+; Mounted: Yes; Socket: No; SMD: Yes; Sense: No; ComponentHeight: 0.94mm; HelpURL: \\cern.ch\dfs\Applications\Altium\Datasheets\FIL_MINI-CIRCUITS_LFCN-3000+.pdf; Author: CERN DEM JLC; CreateDate: 09.12.2013; LatestRevisionDate: 09.12.2013
IC24 = HMC349ALP4CE: DC-4GHz High Isolation SPDT Non-Reflective Switch; Manufacturer: ANALOG DEVICES; PressFit: No; Bonding: No; Part Number: HMC349ALP4CE; Component Kind: Standard; Component Type: Standard; Device: HMC349ALP4CE; PackageDescription: QFN, 0.65mm pitch,square; 4 pin X 4 pin, 4mm X 4mm X 1mm H body (w/thermal tab 2.55 X 2.55mm),  IPC Medium Density; Part Description: DC-4GHz High Isolation SPDT Non-Reflective Switch; Manufacturer Part Number: HMC349ALP4CE; Pin Count: 17; Case: QFN16; Mounted: Yes; Socket: No; SMD: Yes; Sense: No; ComponentHeight: 1mm; Author: CERN DEM JLC; HelpURL: \\cern.ch\dfs\Applications\Altium\Datasheets\HMC349ALP4CE.pdf; CreateDate: 2017-02-23; LatestRevisionDate: 2017-02-23
L54 = IND0603_TDK_MPZ1608R391A: Inductor; Part Description: SMT Chip Bead for Power Line; Manufacturer: TDK; Power: 1.2A; Resistance: 0.12R; Tolerance: ±25%; Part Number: IND0603_TDK_MPZ1608R391A; Component Kind: Standard; Component Type: Standard; Pin Count: 2; Value: 390R@100MHz; Status: None; Manufacturer Part Number: MPZ1608R391A; Case: 0603; Mounted: Yes; Socket: No; SMD: Yes; Sense: No; ComponentHeight: 0.95mm; HelpURL: \\cern.ch\dfs\Applications\Altium\Datasheets\IND0603_TDK_MPZ1608.pdf; Author: CERN DEM JLC; CreateDate: 2009-12-02; LatestRevisionDate: 2009-12-02
MP1 = 3670230: WE-SHC Shielding Cabinet, SMT Frame Seamless, Tin Plated, Tray, 23x11.7x5mm; Manufacturer: Wurth Elektronik; Base Material: Steel; ComponentLink1Description: Website Link; ComponentLink1URL: https://www.we-online.com/redexpert/article/3670230?ad; ComponentLink2Description: Datasheet Link; ComponentLink2URL: https://www.we-online.com/redexpert/spec/3670230?ad; Manufacturer Part Number: 3670230; Category: EMC Shielding; Match Code: WE-SHC; Mount: Surface Mount; Operating Temperature Max: 125°C; Operating Temperature Min: -40°C; Packaging: Tray; Length: 23mm; Width: 11.7mm; Height: 5mm; Plating: Tin Plated; Type: SMT Frame Seamless
R62 R65 = R0402_17R4_1%_0.1W_100PPM: Resistor - 1%; Part Description: General Purpose Thick Film Chip Resistor; Manufacturer: GENERIC; Manufacturer1 Part Number: ERJ2RKF17R4X; Voltage: 50V; Power: 0.1W; TC: ±100ppm/°C; PressFit: No; Case: 0402; Value: 17R4; Tolerance: ±1%; Part Number: R0402_17R4_1%_0.1W_100PPM; Component Kind: Standard; Component Type: Standard; Pin Count: 2; Status: Not Recommended; Manufacturer Part Number: R0402_17R4_1%_0.1W_100PPM; Mounted: Yes; Sense: No; Socket: No; SMD: Yes; Manufacturer1 Example: PANASONIC; Manufacturer1 ComponentHeight: 0.4mm; HelpURL: \\cern.ch\dfs\Applications\Altium\Datasheets\R0402_PANASONIC_ERJ2RK.pdf; Author: CERN DEM BC; CreateDate: 19.04.2021; LatestRevisionDate: 19.04.2021
R63 R64 = R0402_590R_1%_0.1W_100PPM: Resistor - 1%; Part Description: General Purpose Thick Film Chip Resistor; Manufacturer: GENERIC; Manufacturer1 Part Number: ERJ2RKF5900X; Voltage: 50V; Power: 0.1W; TC: ±100ppm/°C; PressFit: No; Case: 0402; Value: 590; Tolerance: ±1%; Part Number: R0402_590R_1%_0.1W_100PPM; Component Kind: Standard; Component Type: Standard; Pin Count: 2; Status: Not Recommended; Manufacturer Part Number: R0402_590R_1%_0.1W_100PPM; Mounted: Yes; Sense: No; Socket: No; SMD: Yes; Manufacturer1 Example: PANASONIC; Manufacturer1 ComponentHeight: 0.4mm; HelpURL: \\cern.ch\dfs\Applications\Altium\Datasheets\R0402_PANASONIC_ERJ2RK.pdf; Author: CERN DEM BC; CreateDate: 19.04.2021; LatestRevisionDate: 19.04.2021
R125-R127 = R0402_0R_JUMPER: as R197 on sheet AWG_CPCIS_Connectors_P1_P6; Part Number: R0402_0R_JUMPER; Component Kind: Standard; Component Type: Standard; Pin Count: 2; Value: 0; Status: Not recommended; Manufacturer Part Number: R0402_0R_JUMPER; Case: 0402; Sense: No; Socket: No; SMD: Yes; Manufacturer1 Example: YAGEO PHYCOMP; Manufacturer1 ComponentHeight: 0.4mm; HelpURL: \\cern.ch\dfs\Applications\Altium\Datasheets\R0402_Phycomp_RC0402.pdf; Author: CERN DEM JLC; CreateDate: 2007-12-03; LatestRevisionDate: 2012-10-17
  R125: Mounted: Yes
R128 R273 = R0402_4K7_1%_0.0625W_100PPM: Resistor - 1%; Part Description: General Purpose Thick Film Chip Resistor; Manufacturer: GENERIC; Manufacturer1 Part Number: 232270674702L; TC: ±100ppm/°C; Part Number: R0402_4K7_1%_0.0625W_100PPM; Component Kind: Standard; Component Type: Standard; Pin Count: 2; Value: 4k7; Status: Not recommended; Power: 0.0625W; Tolerance: ±1%; Manufacturer Part Number: R0402_4K7_1%_0.0625W_100PPM; Case: 0402; Mounted: Yes; Sense: No; Socket: No; SMD: Yes; Manufacturer1 Example: YAGEO PHYCOMP; Manufacturer1 ComponentHeight: 0.4mm; HelpURL: \\cern.ch\dfs\Applications\Altium\Datasheets\R0402_Phycomp_RC0402.pdf; Author: CERN DEM JLC; CreateDate: 2007-12-03; LatestRevisionDate: 2012-10-17
R129 R131 = R0402_100R_1%_0.1W_100PPM: Resistor - 1%; Part Description: General Purpose Thick Film Chip Resistor; Manufacturer: GENERIC; Manufacturer Part Number: R0402_100R_1%_0.1W_100PPM_50V; Manufacturer1 Part Number: ERJ2RKF1000X; Power: 0.1W; TC: ±100ppm/°C; Voltage: 50V; Part Number: R0402_100R_1%_0.1W_100PPM; Component Kind: Standard; Component Type: Standard; Pin Count: 2; Value: 100; Status: Not recommended; Tolerance: ±1%; Case: 0402; Mounted: Yes; Sense: No; Socket: No; SMD: Yes; Manufacturer1 Example: PANASONIC; Manufacturer1 ComponentHeight: 0.4mm; HelpURL: \\cern.ch\dfs\Applications\Altium\Datasheets\R0402_PANASONIC_ERJ2RK.pdf; Author: CERN DEM JLC; CreateDate: 12.12.2013; LatestRevisionDate: 03.03.2015
TR4 = XFMR_MINI-CIRCUITS_TCM2-33WX+: 50 OHMS 10 to 3000 MHz RF Transformer; Power: 0.4W; Part Number: XFMR_MINI-CIRCUITS_TCM2-33WX+; Component Kind: Standard; Component Type: Standard; Pin Count: 6; Value: 1:2; Status: None; Part Description: 50 Ohms 10 to 3000MHz RF Transformer; Manufacturer: MINI-CIRCUITS; Mounted: Yes; Socket: No; Sense: No; SMD: Yes; ComponentHeight: 4.06mm; HelpURL: \\cern.ch\dfs\Applications\Altium\Datasheets\XFMR_MINI-CIRCUITS_TCM2-33WX+.pdf; Author: CERN DEM MR; CreateDate: 01.12.2016; LatestRevisionDate: 01.12.2016